# EAGLE schematic memory (EAGLE 7.1.0)
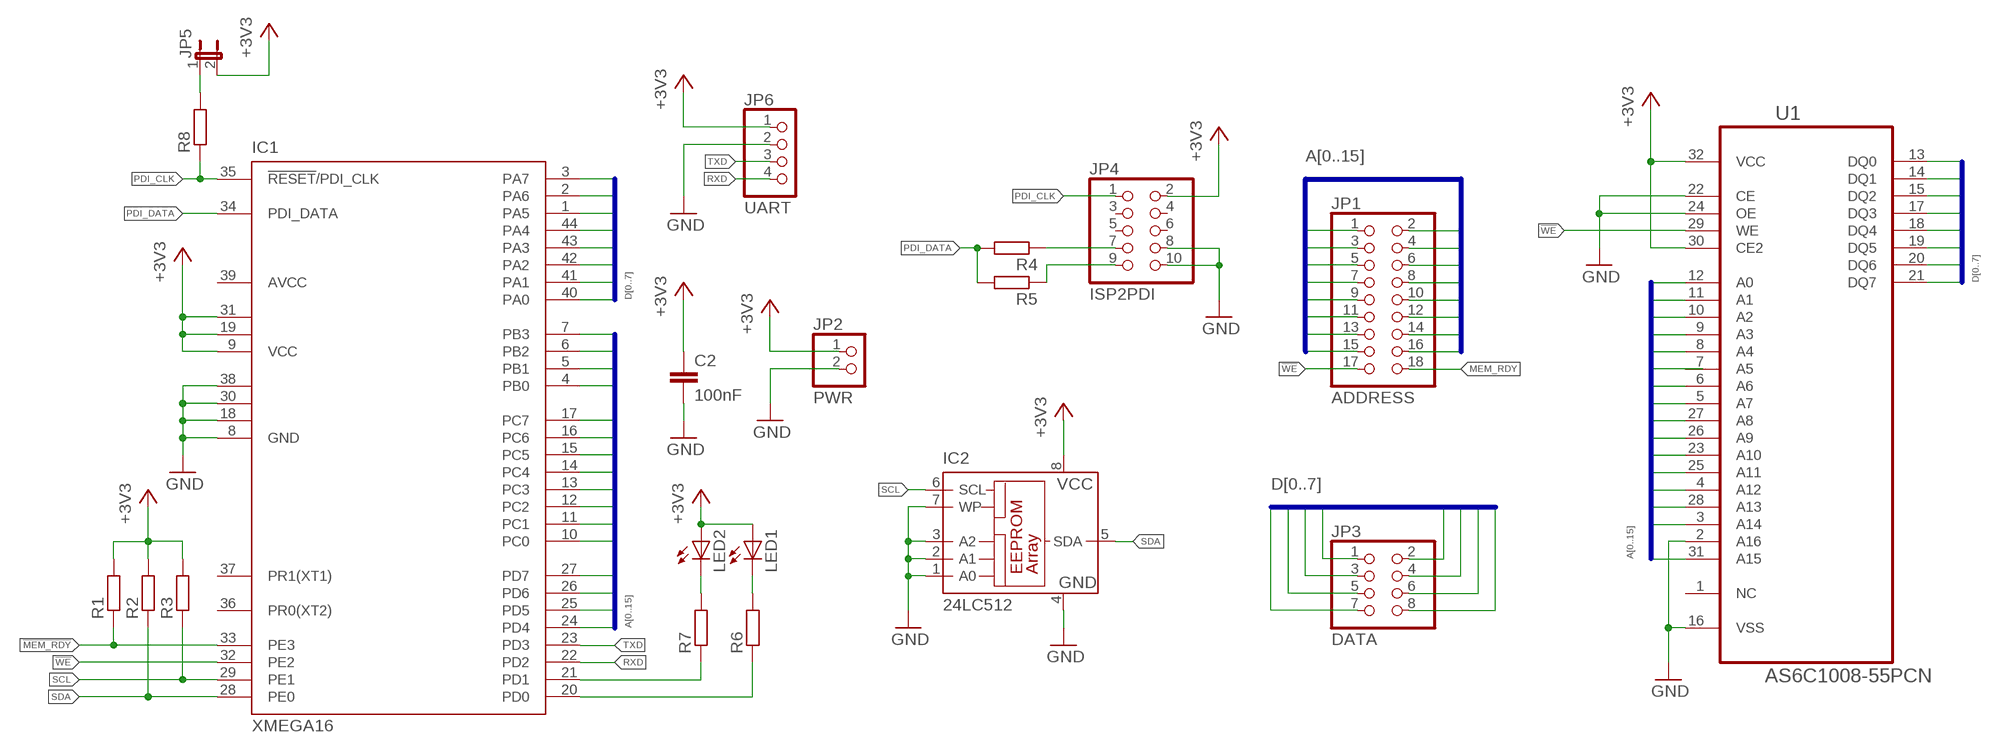
[diagram p0: schematic, sheet 1]

## Parts
C2  100nF  C-EUC0805  [C0805]
IC1  XMEGA16  XMEGA16A4A  [TQFP44]
IC2  24LC512  24LC256SN  [SO-08]
JP1  ADDRESS  PINHD-2X9  [2X09]
JP2  PWR  PINHD-1X2  [1X02]
JP3  DATA  PINHD-2X4  [2X04]
JP4  ISP2PDI  PINHD-2X5  [2X05]
JP5  JP1E  [JP1]
JP6  UART  PINHD-1X4  [1X04]
LED1  LEDSML0805  [SML0805]
LED2  LEDSML0805  [SML0805]
R1  R-EU_M0805  [M0805]
R2  R-EU_M0805  [M0805]
R3  R-EU_M0805  [M0805]
R4  R-EU_M0805  [M0805]
R5  R-EU_M0805  [M0805]
R6  R-EU_M0805  [M0805]
R7  R-EU_M0805  [M0805]
R8  R-EU_M0805  [M0805]
U1  AS6C1008-55PCN  [DIP254P1524X393-32]

## Nets
!MEM_RDY!: IC1.33(PE3) R1.1
!WE!: IC1.32(PE2) JP1.17 U1.29(WE)
+3V3: C2.1 IC1.9(VCC) IC1.19(VCC1) IC1.31(VCC2) IC2.8(VCC) JP2.1 JP4.2 JP5.2 JP6.1 LED1.A LED2.A R1.2 R2.2 R3.2 U1.30(CE2) U1.32(VCC)
A0: IC1.4(PB0) JP1.1 U1.12(A0)
A1: IC1.5(PB1) JP1.2 U1.11(A1)
A2: IC1.6(PB2) JP1.3 U1.10(A2)
A3: IC1.7(PB3) JP1.4 U1.9(A3)
A4: IC1.24(PD4) JP1.5 U1.8(A4)
A5: IC1.25(PD5) JP1.6 U1.7(A5)
A6: IC1.26(PD6) JP1.7 U1.6(A6)
A7: IC1.27(PD7) JP1.8 U1.5(A7)
A8: IC1.10(PC0) JP1.9 U1.27(A8)
A9: IC1.11(PC1) JP1.10 U1.26(A9)
A10: IC1.12(PC2) IC1.13(PC3) JP1.11 U1.23(A10)
A11: JP1.12 U1.25(A11)
A12: IC1.14(PC4) JP1.13 U1.4(A12)
A13: IC1.15(PC5) JP1.14 U1.28(A13)
A14: IC1.16(PC6) JP1.15 U1.3(A14)
A15: IC1.17(PC7) JP1.16 U1.31(A15)
D0: IC1.40(PA0) JP3.1 U1.13(DQ0)
D1: IC1.41(PA1) JP3.2 U1.14(DQ1)
D2: IC1.42(PA2) JP3.3 U1.15(DQ2)
D3: IC1.43(PA3) JP3.4 U1.17(DQ3)
D4: IC1.44(PA4) JP3.5 U1.18(DQ4)
D5: IC1.1(PA5) JP3.6 U1.19(DQ5)
D6: IC1.2(PA6) JP3.7 U1.20(DQ6)
D7: IC1.3(PA7) JP3.8 U1.21(DQ7)
GND: C2.2 IC1.8(GND) IC1.18(GND1) IC1.30(GND2) IC1.38(GND3) IC2.1(A0) IC2.2(A1) IC2.3(A2) IC2.4(GND) IC2.7(WP) JP2.2 JP4.8 JP4.10 JP6.2 U1.2(A16) U1.16(VSS) U1.22(CE) U1.24(OE)
MEM_RDY: JP1.18
N$1: JP4.7 R4.1
N$2: JP4.9 R5.1
N$3: IC1.21(PD1) R7.1
N$4: IC1.20(PD0) R6.1
N$5: LED2.C R7.2
N$6: LED1.C R6.2
N$7: JP5.1 R8.2
PDI_CLK: IC1.35(!RESET!/PDI_CLK) JP4.1 R8.1
PDI_DATA: IC1.34(PDI_DATA) R4.2 R5.2
RXD: IC1.22(PD2) JP6.4
SCL: IC1.29(PE1) IC2.6(SCL) R3.1
SDA: IC1.28(PE0) IC2.5(SDA) R2.1
TXD: IC1.23(PD3) JP6.3
Unconnected: IC1.36(PR0(XT2)) IC1.37(PR1(XT1)) JP4.3 JP4.4 JP4.5 JP4.6 U1.1(NC)

## Buses
A[0..15]
D[0..7]

## Power pins joined to a net without a drawn wire
AVCC: IC1.39(AVCC)

## Library data of the parts
C2 = rcl:C-EU: CAPACITOR, European symbol
IC1 = atmel:XMEGA16A4: MICROCONTROLLER Features High-performance, Low-power 8/16-bit AVR XMEGA Microcontroller Non-Volatile Program and Data Memories - 16 KB - 128 KB of In-System Self-Programmable Flash - 4 KB - 8 KB Boot Code Section with Independent Lock Bits - 1 KB - 2 KB EEPROM - 2 KB - 8 KB Internal SRAM Peripheral Features - Four-channel DMA Controller with support for external requests - Eight-channel Event System - Five 16-bit Timer/Counters Three Timer/Counters with 4 Output Compare or Input Capture channels Two Timer/Counters with 2 Output Compare or Input Capture channels High-Resolution Extensions on all Timer/Counters Advanced Waveform Extension on one Timer/Counter - Five USARTs IrDA Extension on one USART - Two Two-Wire Interfaces with dual address match (I2C and SMBus compatible) - Two SPIs (Serial Peripheral Interfaces) peripherals - AES and DES Crypto Engine - 16-bit Real Time Counter with Separate Oscillator - One Twelve-channel, 12-bit, 2 Msps Analog to Digital Converter - One Two-channel, 12-bit, 1 Msps Digital to Analog Converter - Two Analog Comparators with Window compare function - External Interrupts on all General Purpose I/O pins - Programmable Watchdog Timer with Separate On-chip Ultra Low Power Oscillator Special Microcontroller Features - Power-on Reset and Programmable Brown-out Detection - Internal and External Clock Options with PLL - Programmable Multi-level Interrupt Controller - Sleep Modes: Idle, Power-down, Standby, Power-save, Extended Standby - Advanced Programming, Test and Debugging Interfaces PDI (Program and Debug Interface) for programming, test and debugging I/O and Packages - 34 Programmable I/O Lines - 44 - lead TQFP - 44 - pad VQFN/QFN - 49 - ball VFBGA Operating Voltage - 1.6 - 3.6V Speed performance - 0 - 12 MHz @ 1.6 - 3.6V - 0 - 32 MHz @ 2.7 - 3.6V Drawn by Dipl.-Ing. (FH) Robert Siegler Created: 27.05.09; OC_FARNELL: unknown; OC_NEWARK: unknown
IC2 = microchip:24*: Serial EEPROM I2C; MF: MICROCHIP; MPN: 24LC256-I/SN; OC_FARNELL: 9757996; OC_NEWARK: 27C9144
JP1 = pinhead:PINHD-2X9: PIN HEADER
JP2 = pinhead:PINHD-1X2: PIN HEADER
JP3 = pinhead:PINHD-2X4: PIN HEADER
JP4 = pinhead:PINHD-2X5: PIN HEADER
JP5 = jumper:JP1E: JUMPER
JP6 = pinhead:PINHD-1X4: PIN HEADER
LED1 LED2 = led:LED: LED OSRAM: - CHIPLED LG R971, LG N971, LY N971, LG Q971, LY Q971, LO R971, LY R971 LH N974, LH R974 LS Q976, LO Q976, LY Q976 LO Q996 - Hyper CHIPLED LW Q18S LB Q993, LB Q99A, LB R99A - SideLED LS A670, LO A670, LY A670, LG A670, LP A670 LB A673, LV A673, LT A673, LW A673 LH A674 LY A675 LS A676, LA A676, LO A676, LY A676, LW A676 LS A679, LY A679, LG A679 - Hyper Micro SIDELED® LS Y876, LA Y876, LO Y876, LY Y876 LT Y87S - SmartLED LW L88C, LW L88S LB L89C, LB L89S, LG L890 LS L89K, LO L89K, LY L89K LS L896, LA L896, LO L896, LY L896 - TOPLED LS T670, LO T670, LY T670, LG T670, LP T670 LSG T670, LSP T670, LSY T670, LOP T670, LYG T670 LG T671, LOG T671, LSG T671 LB T673, LV T673, LT T673, LW T673 LH T674 LS T676, LA T676, LO T676, LY T676, LB T676, LH T676, LSB T676, LW T676 LB T67C, LV T67C, LT T67C, LS T67K, LO T67K, LY T67K, LW E67C LS E67B, LA E67B, LO E67B, LY E67B, LB E67C, LV E67C, LT E67C LW T67C LS T679, LY T679, LG T679 LS T770, LO T770, LY T770, LG T770, LP T770 LB T773, LV T773, LT T773, LW T773 LH T774 LS E675, LA E675, LY E675, LS T675 LS T776, LA T776, LO T776, LY T776, LB T776 LHGB T686 LT T68C, LB T68C - Hyper Mini TOPLED® LB M676 - Mini TOPLED Santana® LG M470 LS M47K, LO M47K, LY M47K Source: http://www.osram.convergy.de LUXEON: - LUMILED® LXK2-PW12-R00, LXK2-PW12-S00, LXK2-PW14-U00, LXK2-PW14-V00 LXK2-PM12-R00, LXK2-PM12-S00, LXK2-PM14-U00 LXK2-PE12-Q00, LXK2-PE12-R00, LXK2-PE12-S00, LXK2-PE14-T00, LXK2-PE14-U00 LXK2-PB12-K00, LXK2-PB12-L00, LXK2-PB12-M00, LXK2-PB14-N00, LXK2-PB14-P00, LXK2-PB14-Q00 LXK2-PR12-L00, LXK2-PR12-M00, LXK2-PR14-Q00, LXK2-PR14-R00 LXK2-PD12-Q00, LXK2-PD12-R00, LXK2-PD12-S00 LXK2-PH12-R00, LXK2-PH12-S00 LXK2-PL12-P00, LXK2-PL12-Q00, LXK2-PL12-R00 Source: www.luxeon.com KINGBRIGHT: KA-3528ASYC Source: www.kingbright.com
R1-R8 = rcl:R-EU_: RESISTOR, European symbol
U1 = Alliance_Memory_By_element14_Batch_1:AS6C1008-55PCN: CMOS SRAM; MPN: AS6C1008-55PCN; OC_FARNELL: 1562896; OC_NEWARK: 94M6214; PACKAGE: DIP-32; SUPPLIER: ALLIANCE MEMORY